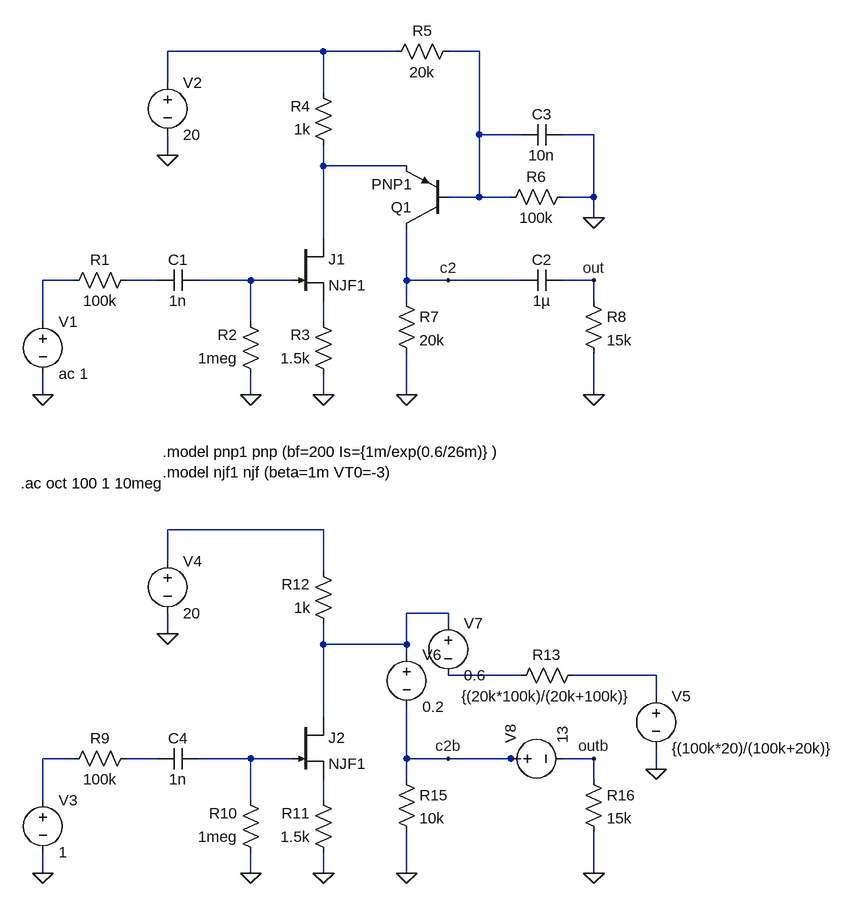
[diagram p0: schematic ss2012_ampl.asc]
ss2012_ampl.asc, the LTspice schematic file:
Version 4
SHEET 1 1288 1060
WIRE 464 -224 224 -224
WIRE 576 -224 464 -224
WIRE 704 -224 656 -224
WIRE 224 -176 224 -224
WIRE 464 -160 464 -224
WIRE 704 -96 704 -224
WIRE 768 -96 704 -96
WIRE 880 -96 832 -96
WIRE 224 -64 224 -96
WIRE 464 -48 464 -80
WIRE 592 -48 464 -48
WIRE 704 0 704 -96
WIRE 704 0 656 0
WIRE 752 0 704 0
WIRE 880 0 880 -96
WIRE 880 0 832 0
WIRE 880 32 880 0
WIRE 464 64 464 -48
WIRE 80 128 32 128
WIRE 208 128 160 128
WIRE 352 128 272 128
WIRE 416 128 352 128
WIRE 592 128 592 48
WIRE 656 128 592 128
WIRE 768 128 656 128
WIRE 880 128 832 128
WIRE 592 160 592 128
WIRE 880 160 880 128
WIRE 32 192 32 128
WIRE 352 192 352 128
WIRE 464 192 464 160
WIRE 32 304 32 272
WIRE 352 304 352 272
WIRE 464 304 464 272
WIRE 592 304 592 240
WIRE 880 304 880 240
WIRE 464 512 224 512
WIRE 224 560 224 512
WIRE 464 576 464 512
WIRE 656 640 592 640
WIRE 656 656 656 640
WIRE 224 672 224 640
WIRE 464 688 464 656
WIRE 592 688 592 640
WIRE 592 688 464 688
WIRE 592 704 592 688
WIRE 768 736 656 736
WIRE 976 736 848 736
WIRE 976 768 976 736
WIRE 464 800 464 688
WIRE 80 864 32 864
WIRE 208 864 160 864
WIRE 352 864 272 864
WIRE 416 864 352 864
WIRE 592 864 592 784
WIRE 656 864 592 864
WIRE 752 864 656 864
WIRE 768 864 752 864
WIRE 880 864 832 864
WIRE 976 880 976 848
WIRE 592 896 592 864
WIRE 880 896 880 864
WIRE 32 928 32 864
WIRE 352 928 352 864
WIRE 464 928 464 896
WIRE 32 1040 32 1008
WIRE 352 1040 352 1008
WIRE 464 1040 464 1008
WIRE 592 1040 592 976
WIRE 880 1040 880 976
FLAG 32 304 0
FLAG 352 304 0
FLAG 464 304 0
FLAG 592 304 0
FLAG 880 304 0
FLAG 224 -64 0
FLAG 880 32 0
FLAG 656 128 c2
FLAG 880 128 out
FLAG 32 1040 0
FLAG 352 1040 0
FLAG 464 1040 0
FLAG 592 1040 0
FLAG 880 1040 0
FLAG 224 672 0
FLAG 656 864 c2b
FLAG 880 864 outb
FLAG 976 880 0
SYMBOL voltage 32 176 R0
WINDOW 123 0 0 Left 2
WINDOW 39 0 0 Left 2
SYMATTR InstName V1
SYMATTR Value ac 1
SYMBOL res 176 112 R90
WINDOW 0 0 56 VBottom 2
WINDOW 3 32 56 VTop 2
SYMATTR InstName R1
SYMATTR Value 100k
SYMBOL res 368 288 R180
WINDOW 0 36 76 Left 2
WINDOW 3 36 40 Left 2
SYMATTR InstName R2
SYMATTR Value 1meg
SYMBOL res 480 288 R180
WINDOW 0 36 76 Left 2
WINDOW 3 36 40 Left 2
SYMATTR InstName R3
SYMATTR Value 1.5k
SYMBOL res 480 -64 R180
WINDOW 0 36 76 Left 2
WINDOW 3 36 40 Left 2
SYMATTR InstName R4
SYMATTR Value 1k
SYMBOL res 560 -208 R270
WINDOW 0 32 56 VTop 2
WINDOW 3 0 56 VBottom 2
SYMATTR InstName R5
SYMATTR Value 20k
SYMBOL res 736 16 R270
WINDOW 0 32 56 VTop 2
WINDOW 3 0 56 VBottom 2
SYMATTR InstName R6
SYMATTR Value 100k
SYMBOL res 576 144 R0
SYMATTR InstName R7
SYMATTR Value 20k
SYMBOL res 864 144 R0
SYMATTR InstName R8
SYMATTR Value 15k
SYMBOL cap 272 112 R90
WINDOW 0 0 32 VBottom 2
WINDOW 3 32 32 VTop 2
SYMATTR InstName C1
SYMATTR Value 1n
SYMBOL cap 832 112 R90
WINDOW 0 0 32 VBottom 2
WINDOW 3 32 32 VTop 2
SYMATTR InstName C2
SYMATTR Value 1µ
SYMBOL njf 416 64 R0
SYMATTR InstName J1
SYMATTR Value NJF1
SYMBOL pnp 656 48 R180
SYMATTR InstName Q1
SYMATTR Value PNP1
SYMBOL voltage 224 -192 R0
WINDOW 123 0 0 Left 2
WINDOW 39 0 0 Left 2
SYMATTR InstName V2
SYMATTR Value 20
SYMBOL cap 832 -80 M270
WINDOW 0 32 32 VTop 2
WINDOW 3 0 32 VBottom 2
SYMATTR InstName C3
SYMATTR Value 10n
SYMBOL voltage 32 912 R0
WINDOW 123 0 0 Left 2
WINDOW 39 0 0 Left 2
SYMATTR InstName V3
SYMATTR Value 1
SYMBOL res 176 848 R90
WINDOW 0 0 56 VBottom 2
WINDOW 3 32 56 VTop 2
SYMATTR InstName R9
SYMATTR Value 100k
SYMBOL res 368 1024 R180
WINDOW 0 36 76 Left 2
WINDOW 3 36 40 Left 2
SYMATTR InstName R10
SYMATTR Value 1meg
SYMBOL res 480 1024 R180
WINDOW 0 36 76 Left 2
WINDOW 3 36 40 Left 2
SYMATTR InstName R11
SYMATTR Value 1.5k
SYMBOL res 480 672 R180
WINDOW 0 36 76 Left 2
WINDOW 3 36 40 Left 2
SYMATTR InstName R12
SYMATTR Value 1k
SYMBOL res 576 880 R0
SYMATTR InstName R15
SYMATTR Value 10k
SYMBOL res 864 880 R0
SYMATTR InstName R16
SYMATTR Value 15k
SYMBOL cap 272 848 R90
WINDOW 0 0 32 VBottom 2
WINDOW 3 32 32 VTop 2
SYMATTR InstName C4
SYMATTR Value 1n
SYMBOL njf 416 800 R0
SYMATTR InstName J2
SYMATTR Value NJF1
SYMBOL voltage 224 544 R0
WINDOW 123 0 0 Left 2
WINDOW 39 0 0 Left 2
SYMATTR InstName V4
SYMATTR Value 20
SYMBOL res 864 720 R90
WINDOW 0 0 56 VBottom 2
WINDOW 3 32 56 VTop 2
SYMATTR InstName R13
SYMATTR Value {(20k*100k)/(20k+100k)}
SYMBOL voltage 976 752 R0
WINDOW 123 0 0 Left 2
WINDOW 39 0 0 Left 2
SYMATTR InstName V5
SYMATTR Value {(100k*20)/(100k+20k)}
SYMBOL voltage 592 688 R0
WINDOW 123 0 0 Left 2
WINDOW 39 0 0 Left 2
SYMATTR InstName V6
SYMATTR Value 0.2
SYMBOL voltage 656 640 R0
WINDOW 123 0 0 Left 2
WINDOW 39 0 0 Left 2
SYMATTR InstName V7
SYMATTR Value 0.6
SYMBOL voltage 736 864 R270
WINDOW 123 0 0 Left 2
WINDOW 39 0 0 Left 2
SYMATTR InstName V8
SYMATTR Value 13
TEXT 216 392 Left 2 !.model pnp1 pnp (bf=200 Is={1m/exp(0.6/26m)} )\n.model njf1 njf (beta=1m VT0=-3)
TEXT -2 440 Left 2 !.ac oct 100 1 10meg

The netlist it stands for:
* ss2012_ampl.asc
V1 N004 0 ac 1
R1 N005 N004 100k
R2 0 N006 1meg
R3 0 N007 1.5k
R4 N003 N001 1k
R5 N001 N002 20k
R6 N002 0 100k
R7 c2 0 20k
R8 out 0 15k
C1 N006 N005 1n
C2 out c2 1µ
J1 N003 N006 N007 NJF1
Q1 c2 N002 N003 0 PNP1
V2 N001 0 20
C3 0 N002 10n
V3 N012 0 1
R9 N013 N012 100k
R10 0 N014 1meg
R11 0 N015 1.5k
R12 N009 N008 1k
R15 c2b 0 10k
R16 outb 0 15k
C4 N014 N013 1n
J2 N009 N014 N015 NJF1
V4 N008 0 20
R13 N011 N010 {(20k*100k)/(20k+100k)}
V5 N011 0 {(100k*20)/(100k+20k)}
V6 N009 c2b 0.2
V7 N009 N010 0.6
V8 c2b outb 13
.model NPN NPN
.model PNP PNP
.lib standard.bjt
.model NJF NJF
.model PJF PJF
.lib standard.jft
.model pnp1 pnp (bf=200 Is={1m/exp(0.6/26m)} )
.model njf1 njf (beta=1m VT0=-3)
.ac oct 100 1 10meg
.backanno
.end